# Altium schematic sheet 07 CAMERA-MIPI.SchDoc
size 420 x 297 mm; Organization: Altium Limited; Address1: L3, 12a Rodborough Rd; Address2: Frenchs Forest; Address3: NSW; Address4: Australia 2086
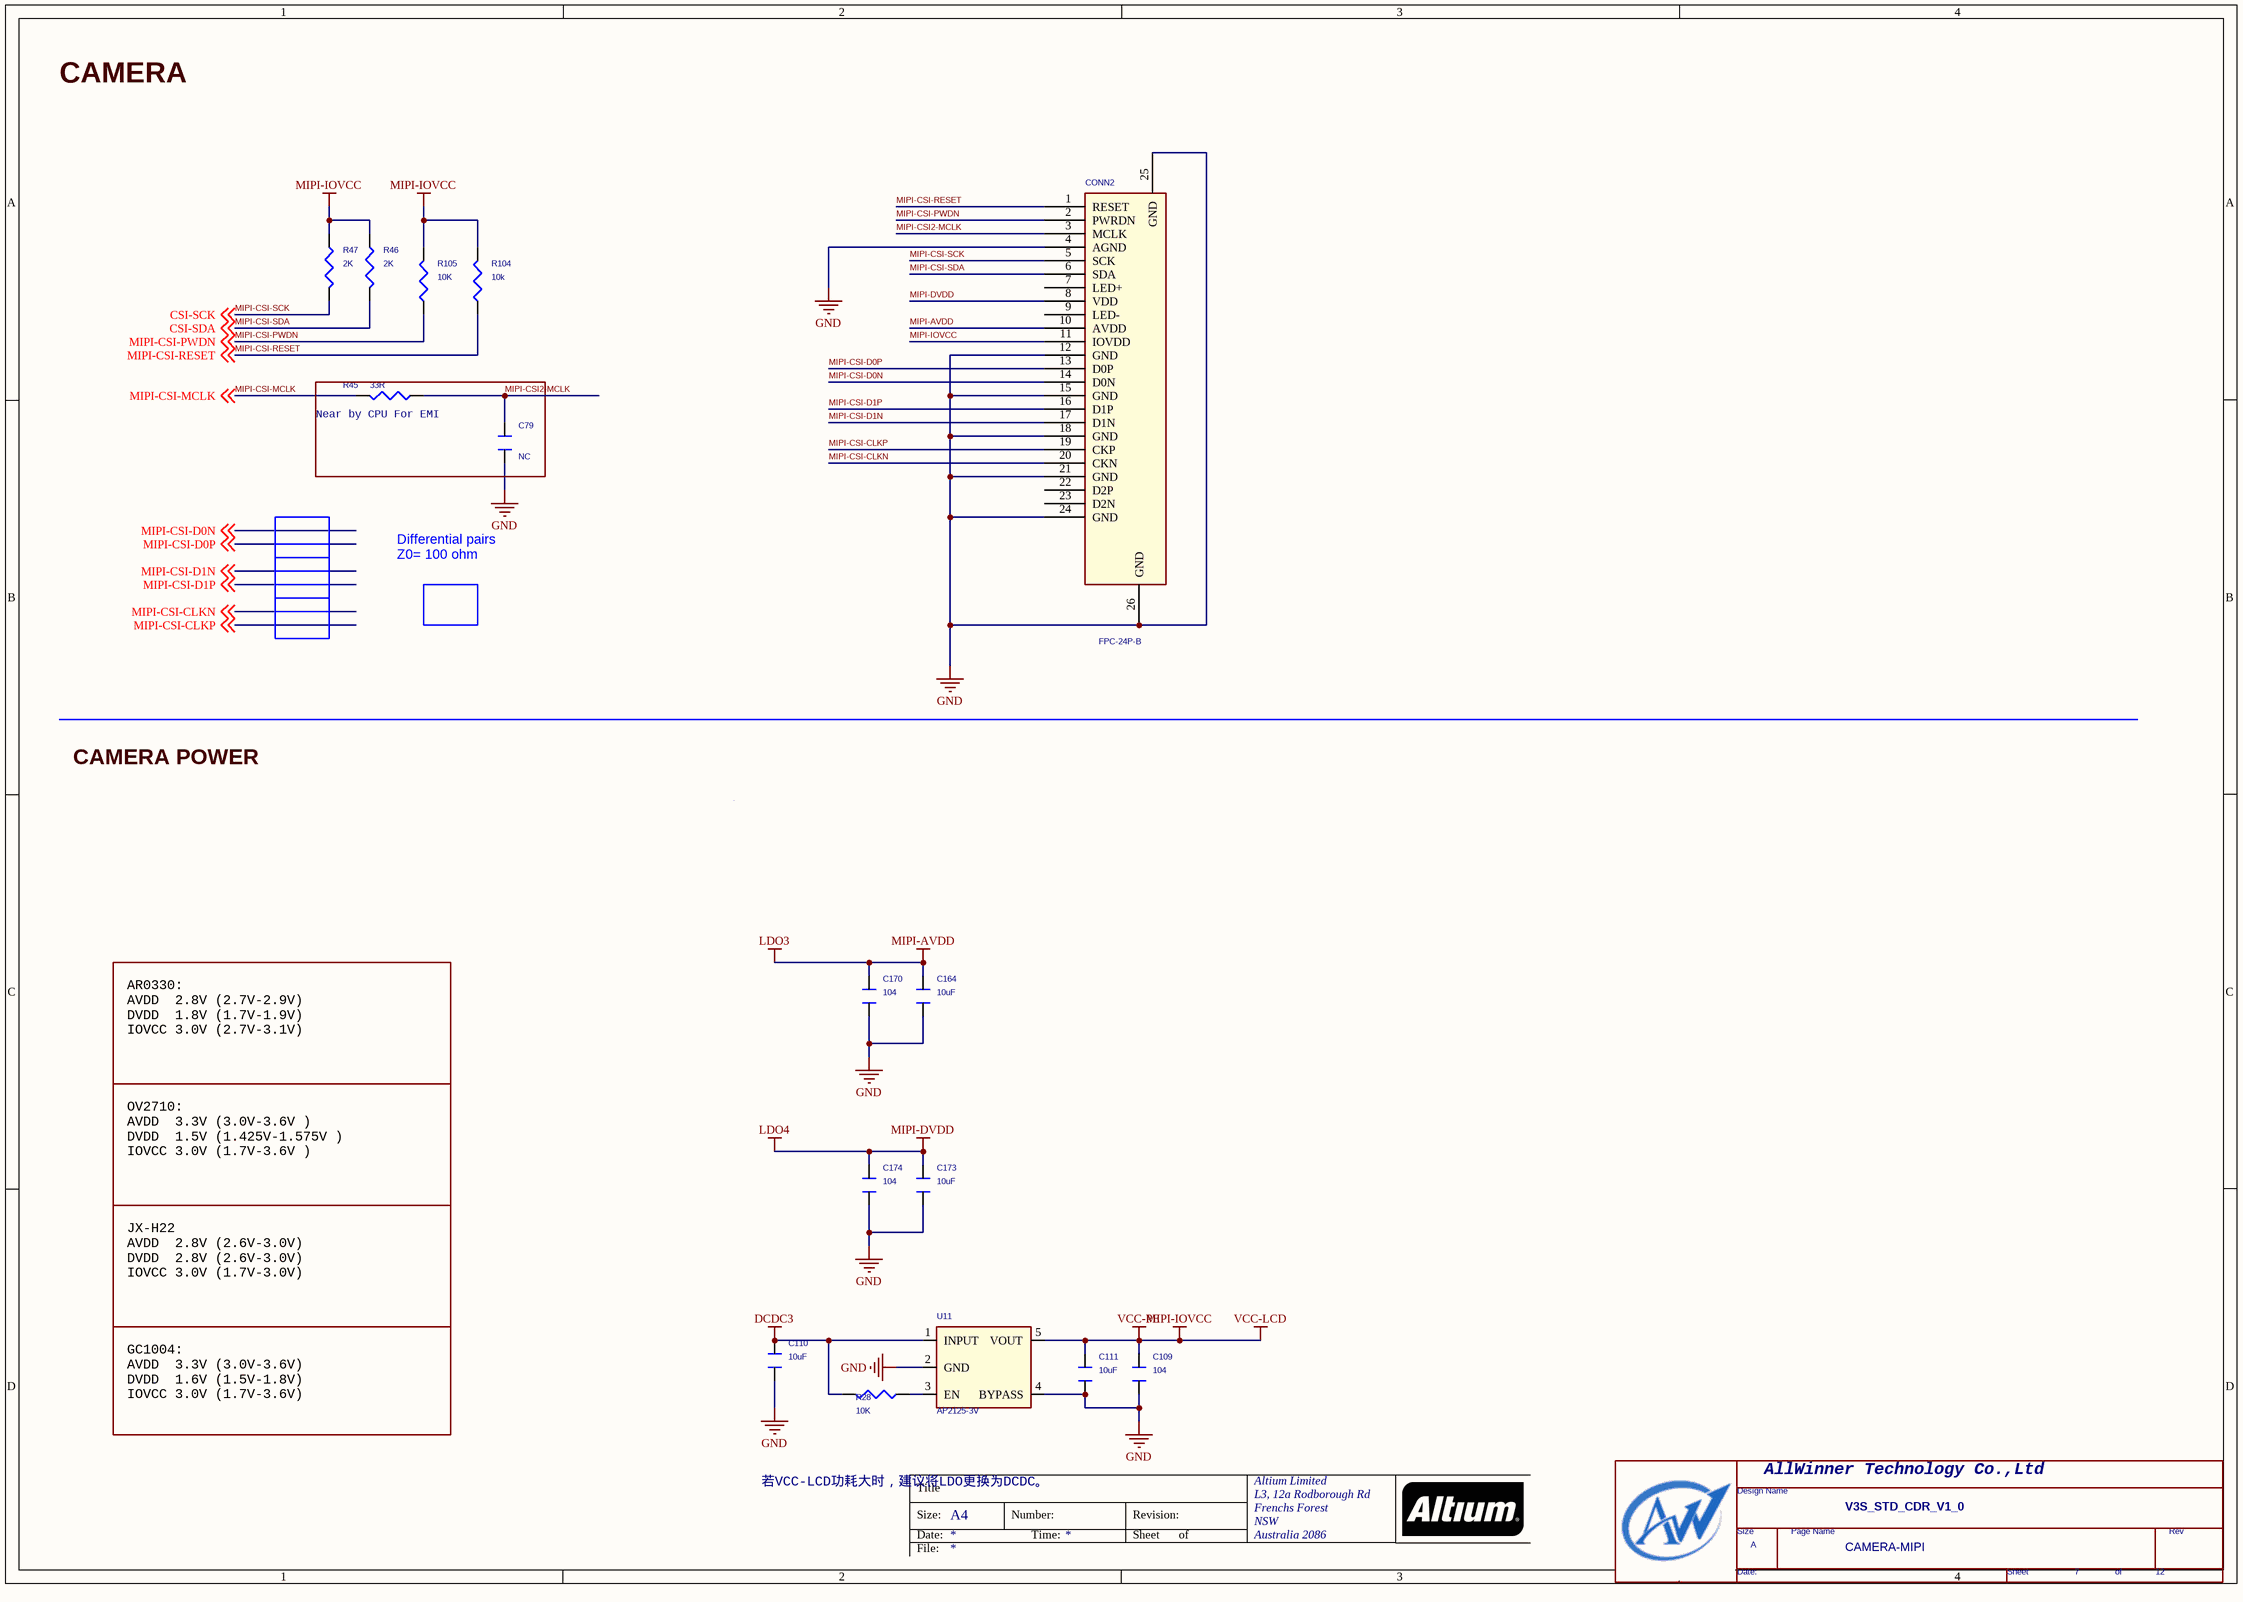
[diagram p0: 07 CAMERA-MIPI.SchDoc]

## Parts
*  Page Count: 12  Page Number: 7  Page Size: A  Title: V3S_STD_CDR_V1_0  Doc: CAMERA-MIPI  (hidden comment: TitleBlock0-AW)  (graphical)
C79  NC  [C0402]
C109  104  [C0402]
C110  10uF  [C0603]
C111  10uF  [C0603]
C164  10uF  [C0603]
C170  104  [C0402]
C173  10uF  [C0603]
C174  104  [C0402]
CONN2  FPC-24P-B  [CON40]
R28  10K  [R0402]
R45  33R  [R0603]
R46  2K  [R0402]
R47  2K  [R0402]
R104  10k  [R0402]
R105  10K  [R0402]
U11  AP2125-3V  [SOT23-5]

## Blocks framed on the sheet
Near by CPU For EMI: C79 R45

## Nets
DCDC3: C110.1 R28.2 U11.1(INPUT)
GND: C79.1 C109.1 C110.2 C111.2 C164.2 C170.1 C173.2 C174.1 CONN2.4(AGND) CONN2.12(GND) CONN2.15(GND) CONN2.18(GND) CONN2.21(GND) CONN2.24(GND) CONN2.25(GND) CONN2.26(GND) U11.2(GND) U11.4(BYPASS)
MIPI-AVDD: C164.1 C170.2 CONN2.10(AVDD)  [also labelled LDO3]
MIPI-DVDD: C173.1 C174.2 CONN2.8(VDD)  [also labelled LDO4]
MIPI-IOVCC: C109.2 C111.1 CONN2.11(IOVDD) R46.1 R47.1 R104.2 R105.2 U11.5(VOUT)  [also labelled VCC-LCD, VCC-PE]
MIPI-CSI2-MCLK: C79.2 CONN2.3(MCLK) R45.1
MIPI-CSI-CLKN: CONN2.20(CKN) ; off-sheet MIPI-CSI-CLKN
MIPI-CSI-CLKP: CONN2.19(CKP) ; off-sheet MIPI-CSI-CLKP
MIPI-CSI-D0N: CONN2.14(D0N) ; off-sheet MIPI-CSI-D0N
MIPI-CSI-D0P: CONN2.13(D0P) ; off-sheet MIPI-CSI-D0P
MIPI-CSI-D1N: CONN2.17(D1N) ; off-sheet MIPI-CSI-D1N
MIPI-CSI-D1P: CONN2.16(D1P) ; off-sheet MIPI-CSI-D1P
MIPI-CSI-MCLK: R45.2 ; off-sheet MIPI-CSI-MCLK
MIPI-CSI-PWDN: CONN2.2(PWRDN) R105.1 ; off-sheet MIPI-CSI-PWDN
MIPI-CSI-RESET: CONN2.1(RESET) R104.1 ; off-sheet MIPI-CSI-RESET
MIPI-CSI-SCK: CONN2.5(SCK) R47.2 ; off-sheet CSI-SCK  [also labelled CSI-SCK]
MIPI-CSI-SDA: CONN2.6(SDA) R46.2 ; off-sheet CSI-SDA  [also labelled CSI-SDA]
NetR28_1: R28.1 U11.3(EN)

Not connected (* = marked no-connect by the designer): CONN2 7(LED+) 9(LED-) 22(D2P) 23(D2N)

## Notes on the sheet
- CAMERA
- Differential pairs
  Z0= 100 ohm
- CAMERA POWER
- AR0330:
  AVDD  2.8V (2.7V-2.9V)
  DVDD  1.8V (1.7V-1.9V)
  IOVCC 3.0V (2.7V-3.1V)
- OV2710:
  AVDD  3.3V (3.0V-3.6V )
  DVDD  1.5V (1.425V-1.575V )
  IOVCC 3.0V (1.7V-3.6V )
- JX-H22
  AVDD  2.8V (2.6V-3.0V)
  DVDD  2.8V (2.6V-3.0V)
  IOVCC 3.0V (1.7V-3.0V)
- GC1004:
  AVDD  3.3V (3.0V-3.6V)
  DVDD  1.6V (1.5V-1.8V)
  IOVCC 3.0V (1.7V-3.6V)
- 若VCC-LCD功耗大时，建议将LDO更换为DCDC。
- Title
- Size:
- Date:
- A4
- Number:
- Time:
- Revision:
- Sheet
- of
- File:
- (in symbol TitleBlock0-AW) AllWinner Technology Co.,Ltd; Design Name; Size; Page Name; Rev; Date:; Sheet; of

## Library data of the parts
C79 = CAPACITOR_0_Dup5: PAGE: 2
C109 = CAPACITOR_0_Dup5: PAGE: 5
C110 C111 = CAPACITOR_2: PAGE: 5
C164 C173 = CAPACITOR_2: PAGE: 4
C170 C174 = CAPACITOR_0_Dup5: PAGE: 4
CONN2 = TD030673_2: Page: 10
R28 = R_Dup4: Page: 7; ROOM: PMU
R45 = RESISTOR_0
R46 R47 = R_Dup4
R104 R105 = R_Dup3: PAGE: 4
U11 = LP3985IM5-3_2.3: PAGE: 5
* = TitleBlock0-AW: Page Create Date: March  8, 1995